# EAGLE design 3ch_LD_driver (EAGLE 9.7.0)
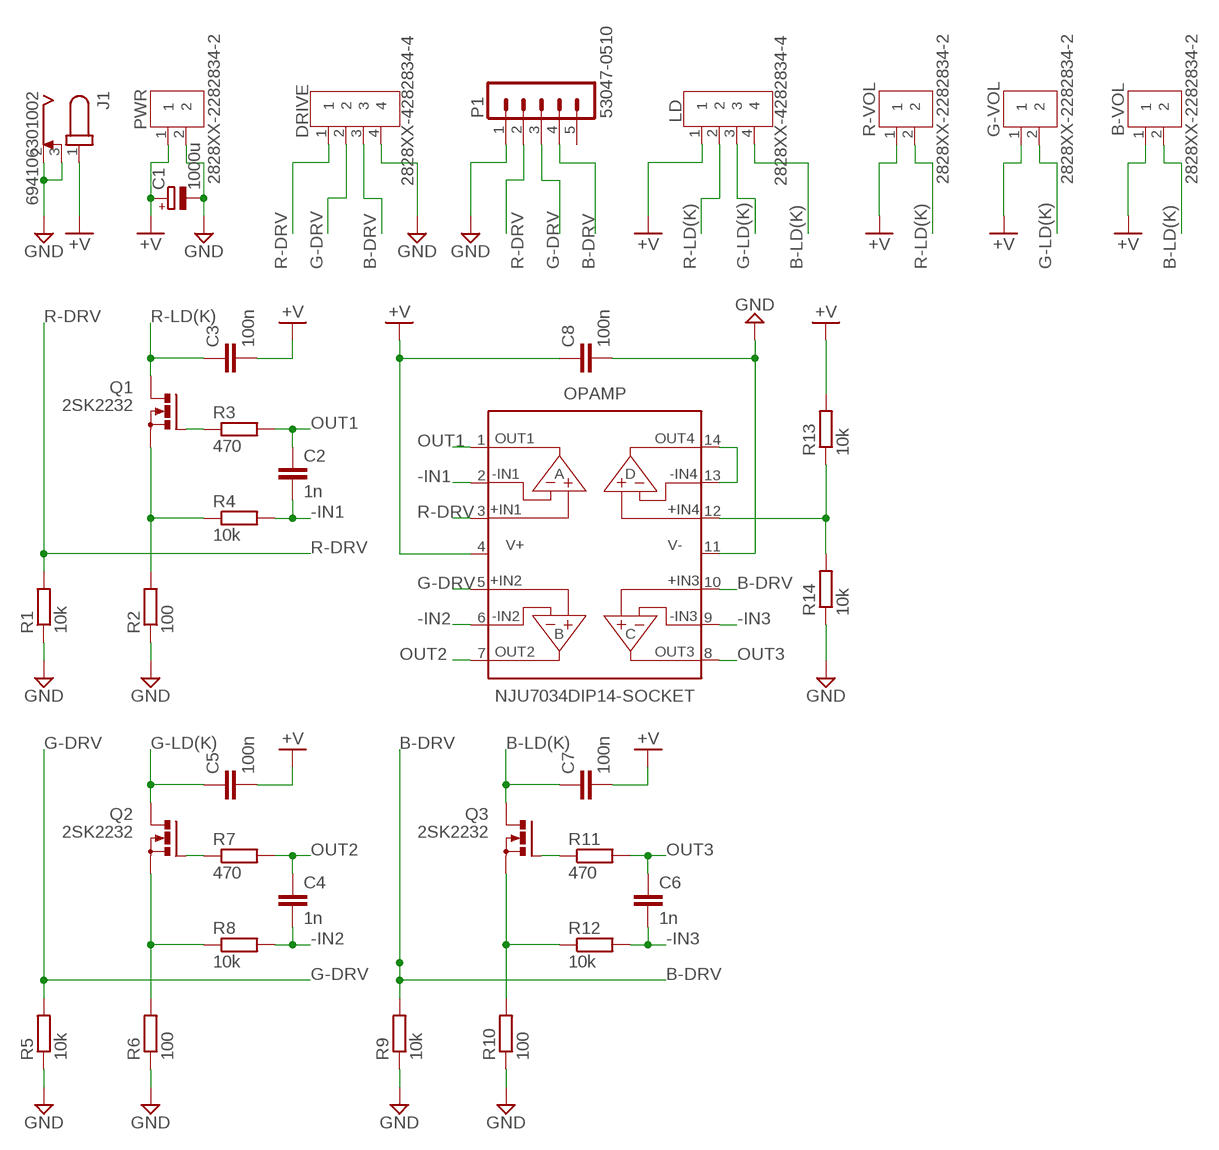
[diagram p0: schematic, sheet 1]

## Parts
B-VOL  2828XX-2282834-2  [TERMBLK_254-2N]
C1  1000u  CPOL-EUE5-10.5  [E5-10,5]
C2  1n  C-EU025-024X044  [C025-024X044]
C3  100n  C-EU025-024X044  [C025-024X044]
C4  1n  C-EU025-024X044  [C025-024X044]
C5  100n  C-EU025-024X044  [C025-024X044]
C6  1n  C-EU025-024X044  [C025-024X044]
C7  100n  C-EU025-024X044  [C025-024X044]
C8  100n  C-EU025-024X044  [C025-024X044]
DRIVE  2828XX-4282834-4  [TERMBLK_254-4N]
G-VOL  2828XX-2282834-2  [TERMBLK_254-2N]
J1  694106301002  [694106301002]
LD  2828XX-4282834-4  [TERMBLK_254-4N]
OPAMP  NJU7034DIP14-SOCKET  [DIP14-SOCKET]
P1  53047-0510  [53047-0510]
PWR  2828XX-2282834-2  [TERMBLK_254-2N]
Q1  2SK2232  PMOSFET_NTO220BV  [TO220BV]
Q2  2SK2232  PMOSFET_NTO220BV  [TO220BV]
Q3  2SK2232  PMOSFET_NTO220BV  [TO220BV]
R1  10k  R-EU_0207/10  [0207/10]
R2  100  R-EU_0207/10  [0207/10]
R3  470  R-EU_0207/10  [0207/10]
R4  10k  R-EU_0207/10  [0207/10]
R5  10k  R-EU_0207/10  [0207/10]
R6  100  R-EU_0207/10  [0207/10]
R7  470  R-EU_0207/10  [0207/10]
R8  10k  R-EU_0207/10  [0207/10]
R9  10k  R-EU_0207/10  [0207/10]
R10  100  R-EU_0207/10  [0207/10]
R11  470  R-EU_0207/10  [0207/10]
R12  10k  R-EU_0207/10  [0207/10]
R13  10k  R-EU_0207/10  [0207/10]
R14  10k  R-EU_0207/10  [0207/10]
R-VOL  2828XX-2282834-2  [TERMBLK_254-2N]

## Nets
+V: B-VOL.1 C1.+ C3.2 C5.2 C7.2 C8.1 G-VOL.1 J1.1 LD.1 OPAMP.4(V+) PWR.1 R13.2 R-VOL.1
-IN1: C2.2 OPAMP.2(-IN1) R4.2
-IN2: C4.2 OPAMP.6(-IN2) R8.2
-IN3: C6.2 OPAMP.9(-IN3) R12.2
B-DRV: DRIVE.3 OPAMP.10(+IN3) P1.4 R9.2
B-LD(K): B-VOL.2 C7.1 LD.4 Q3.D
G-DRV: DRIVE.2 OPAMP.5(+IN2) P1.3 R5.2
G-LD(K): C5.1 G-VOL.2 LD.3 Q2.D
GND: C1.- C8.2 DRIVE.4 J1.2 J1.3 OPAMP.11(V-) P1.1 PWR.2 R1.1 R2.1 R5.1 R6.1 R9.1 R10.1 R14.1
N$1: Q2.S R6.2 R8.1
N$2: Q1.G R3.1
N$3: Q1.S R2.2 R4.1
N$4: Q2.G R7.1
N$5: Q3.S R10.2 R12.1
N$6: Q3.G R11.1
N$7: OPAMP.13(-IN4) OPAMP.14(OUT4)
N$8: OPAMP.12(+IN4) R13.1 R14.2
OUT1: C2.1 OPAMP.1(OUT1) R3.2
OUT2: C4.1 OPAMP.7(OUT2) R7.2
OUT3: C6.1 OPAMP.8(OUT3) R11.2
R-DRV: DRIVE.1 OPAMP.3(+IN1) P1.2 R1.2
R-LD(K): C3.1 LD.2 Q1.D R-VOL.2
Unconnected: P1.5

## Library data of the parts
B-VOL G-VOL PWR R-VOL = Connector:2828XX-2: 2 Position Wire to Board Terminal Block Horizontal with Board Datasheet <https://www.te.com.cn/commerce/DocumentDelivery/DDEController?Action=showdoc&DocId=Catalog+Section%7F1308389_EUROSTYLE_TERMINAL_BLOCKS%7F0607%7Fpdf%7FEnglish%7FENG_CS_1308389_EUROSTYLE_TERMINAL_BLOCKS_0607.pdf%7F2-282837-5>
C1 = rcl:CPOL-EU: POLARIZED CAPACITOR, European symbol; SPICEPREFIX: C
C2-C8 = rcl:C-EU: CAPACITOR, European symbol; SPICEPREFIX: C
DRIVE LD = Connector:2828XX-4: 4 Position Wire to Board Terminal Block Horizontal with Board Datasheet <https://www.te.com.cn/commerce/DocumentDelivery/DDEController?Action=showdoc&DocId=Catalog+Section%7F1308389_EUROSTYLE_TERMINAL_BLOCKS%7F0607%7Fpdf%7FEnglish%7FENG_CS_1308389_EUROSTYLE_TERMINAL_BLOCKS_0607.pdf%7F2-282837-5>; CATEGORY: Connector; DESCRIPTION: TERM BLK 4P SIDE ENT 2.54mm PCB; MANUFACTURER: TE Connectivity; MPN: 282834-4; OPERATING_TEMPERATURE: 40°C to +105°C; PART_STATUS: Active; ROHS_COMPLIANCE: RoHS Compliant; SERIES: 282834; SUBCATEGORY: Terminal Block; TYPE: Side Wire Entry
J1 = DC Power Jacks:694106301002: CONN PWR JACK 2.1X5.5MM SOLDER Manufacturer's datasheet <https://katalog.we-online.de/em/datasheet/6941xx301002.pdf>; CREATED_BY: PCBLayout.com; DIGIKEY_PART_NUMBER: 732-5930-ND; MANUFACTURER: Wurth Electronics Inc.; MPN: 694106301002
OPAMP = 秋月電子通商:NJU7034
P1 = molex:53047-0510: HEADER Check availability <https://pricing.snapeda.com/parts/53047-0510/Molex/view-part?ref=eda>; AVAILABILITY: In Stock; DESCRIPTION: Connector Header Through Hole 5 position 0.049 (1.25mm); MF: Molex; MP: 53047-0510; PACKAGE: None; PRICE: None; PURCHASE-URL: https://pricing.snapeda.com/search/part/53047-0510/?ref=eda
Q1-Q3 = transistor-power:PMOSFET_N: Power MOSFET N-Channel
R1-R14 = rcl:R-EU_: RESISTOR, European symbol; SPICEPREFIX: R

## Net classes
0 default: width 0.61 mm, clearance 0.508 mm

## Board
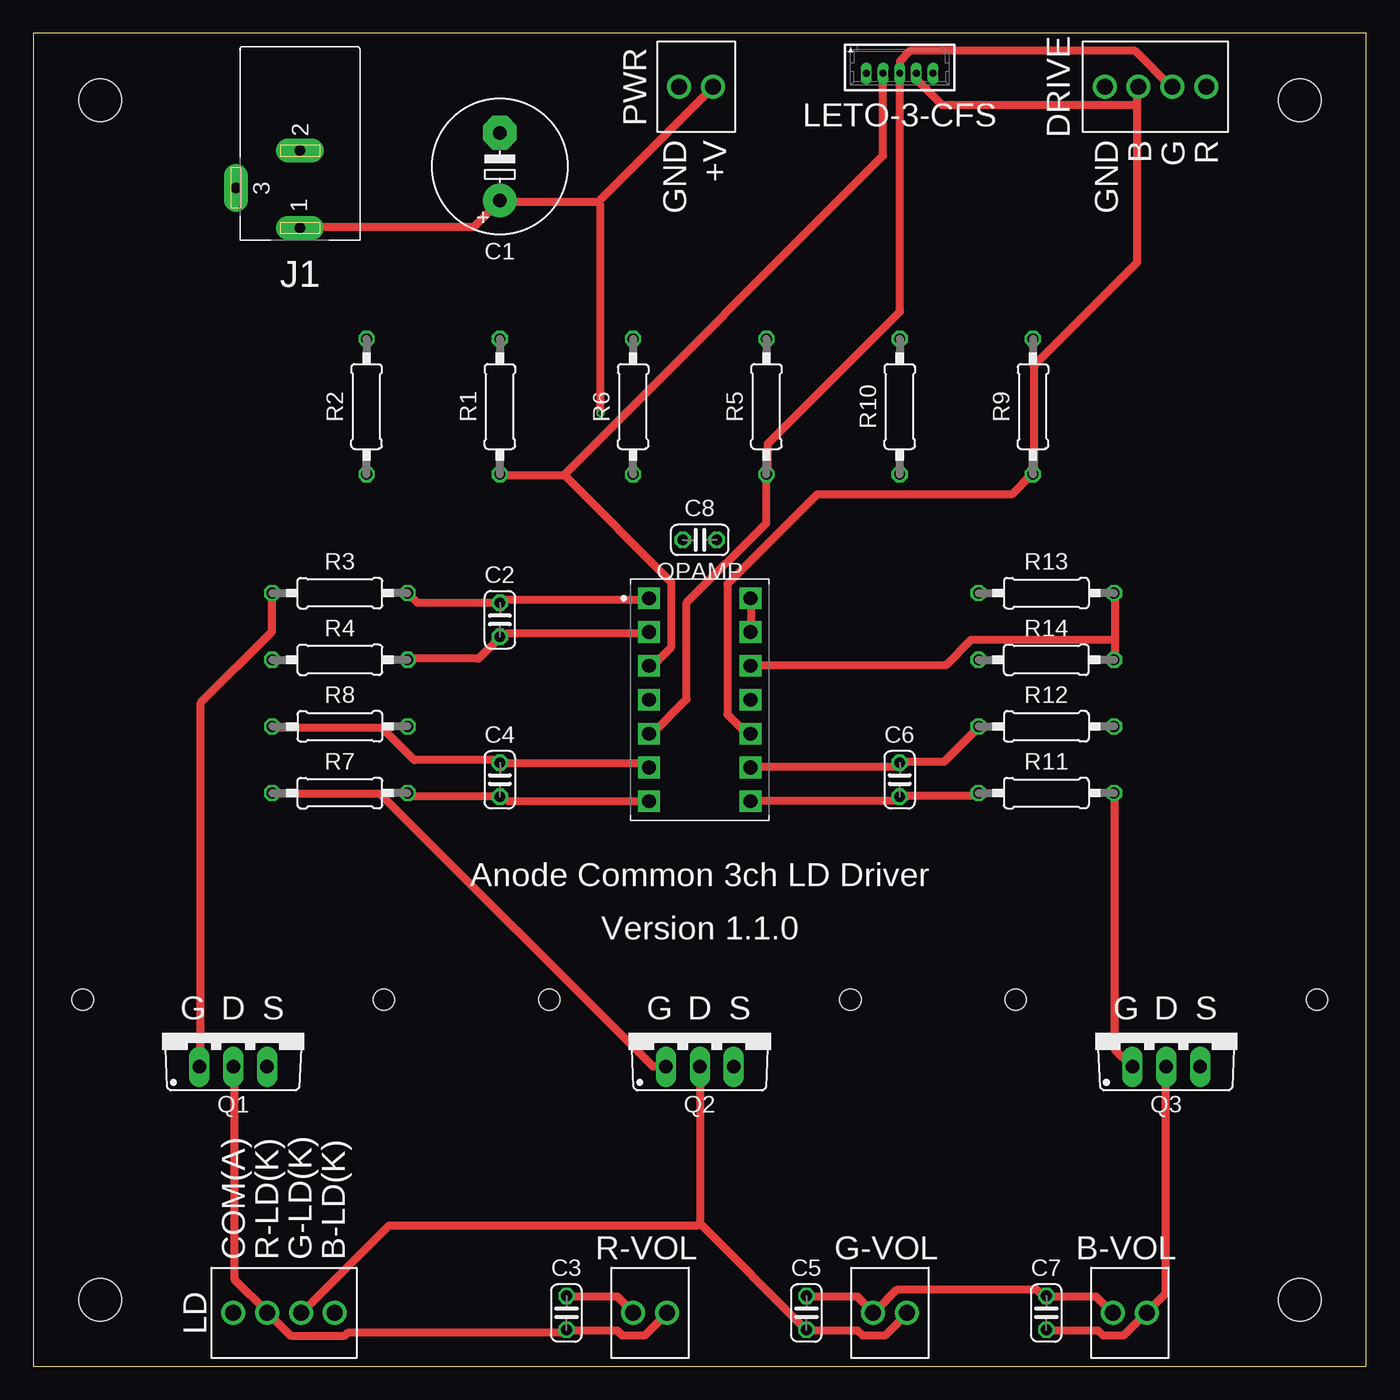
[diagram p1: board, top side]
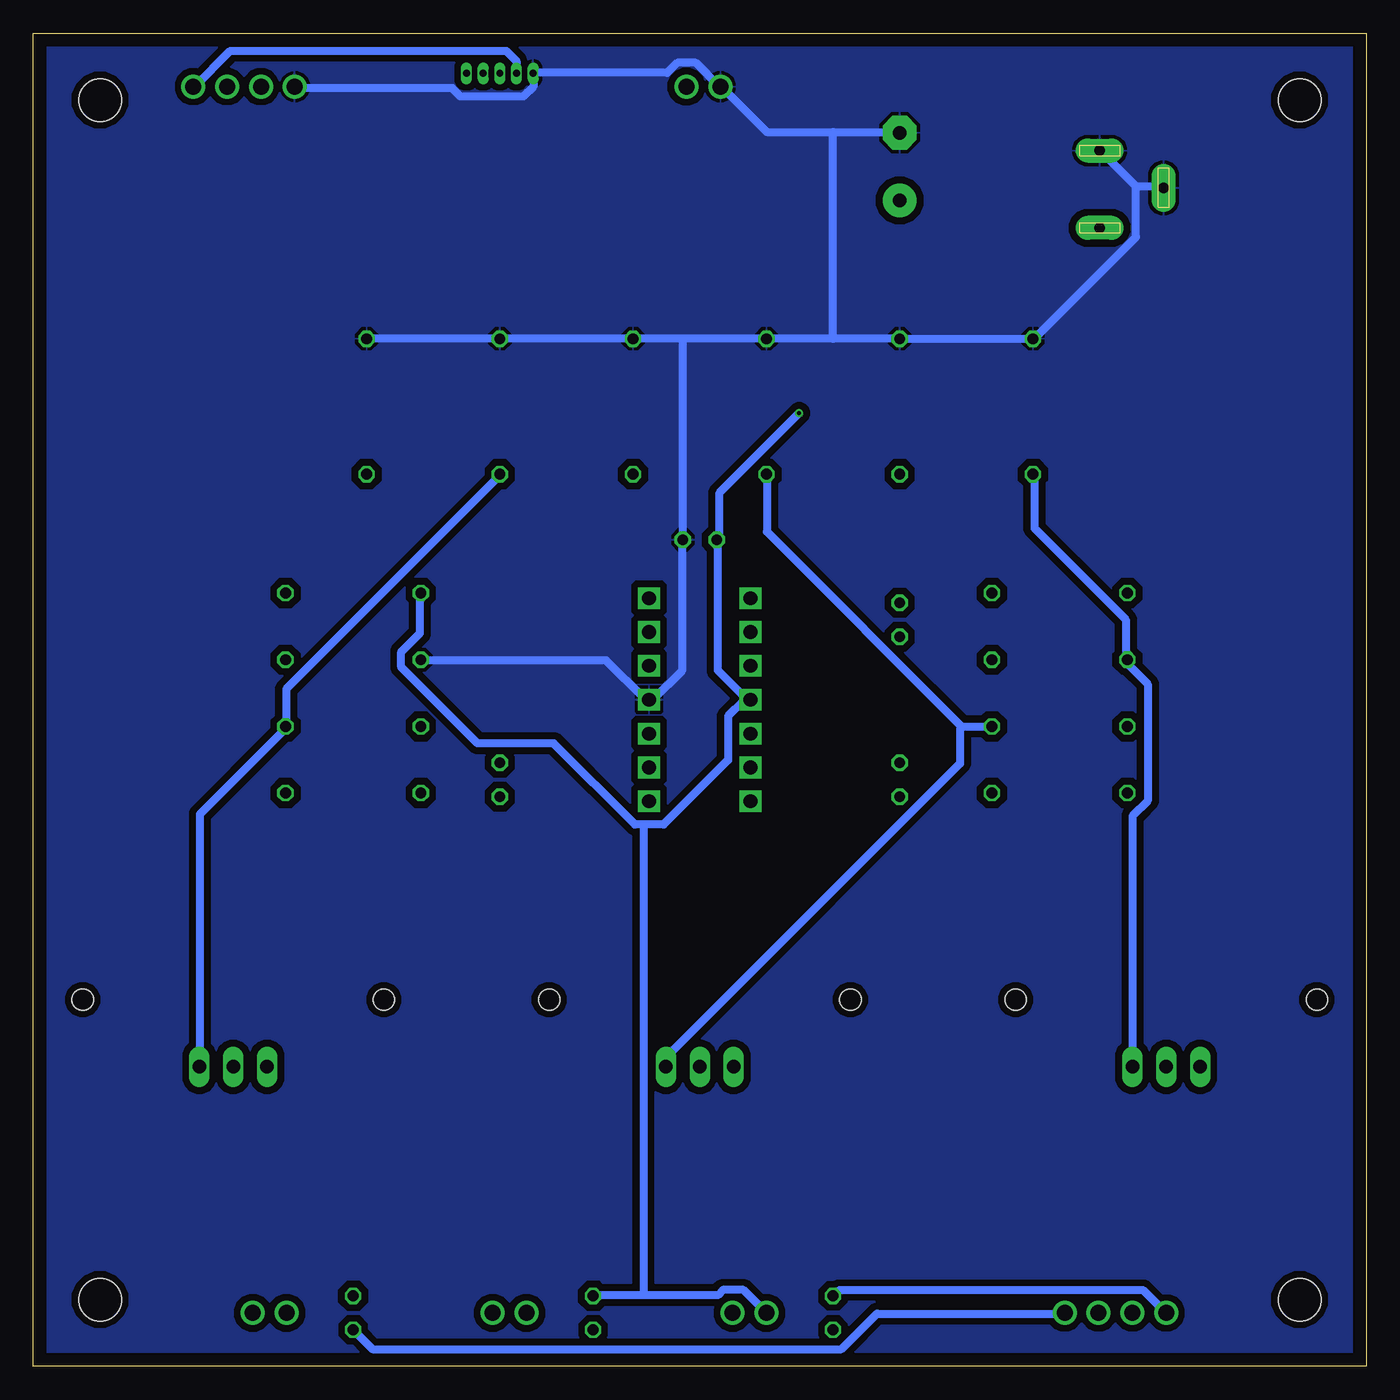
[diagram p2: board, bottom side, seen from below]

Size 100 x 100 mm. Coordinates in mm from the lower left corner, seen from the top.
Outline: 0,0 100,0 100,100 0,100 0,0
Copper layers (1*16): Top / Bottom
Stack-up Default Layer Stack: Top User Defined 0.035mm / Dielectric-1 User Defined 1.6mm / Bottom User Defined 0.035mm
Design rules "Elecrow_2-layer_PCB_eagle_rule": minimum track width 6mil, minimum drill 12mil, track to track 6mil, track to pad 6mil, pad to pad 6mil, via to via 8mil, smd to smd 0mil, copper to edge 20mil, drill to drill 10mil, minimum pad ring 6mil, minimum via ring 6mil, stop-mask expansion 0mil, vias tented up to drill 100mil, thermal gap 10mil
Holes 3.2 mm at 5,95 5,5 95,5 95,95
Holes 1.6 mm at 26.3,27.5 3.7,27.5 38.7,27.5 61.3,27.5 73.7,27.5 96.3,27.5

### Footprints (pad centres in the part's own frame; a part is rotated, then mirrored left to right if it is on the bottom)
TERMBLK_254-2N = drill 1.2: 1 0,0; 2 2.54,0
E5-10,5 = drill 1.016 pad 2.54: + -2.54,0 | drill 1.016 pad 2.54 octagon: - 2.54,0
C025-024X044 = drill 0.813 octagon: 1 -1.27,0; 2 1.27,0
TERMBLK_254-4N = drill 1.2: 1 0,0; 2 2.54,0; 3 5.08,0; 4 7.62,0
694106301002 = drill 0.8 pad 1.8 long: 1 13.6,0; 2 7.8,0; 3 10.6,-4.8
DIP14-SOCKET = drill 1.02 pad 1.62 square: 1 -3.81,7.62; 2 -3.81,5.08; 3 -3.81,2.54; 4 -3.81,0; 5 -3.81,-2.54; 6 -3.81,-5.08; 7 -3.81,-7.62; 8 3.81,-7.62; 9 3.81,-5.08; 10 3.81,-2.54; 11 3.81,0; 12 3.81,2.54; 13 3.81,5.08; 14 3.81,7.62
53047-0510 = drill 0.508 long: 1 2.5,0; 2 1.25,0; 3 0,0; 4 -1.25,0; 5 -2.5,0
TO220BV = drill 1.016 long: D 0,-2.54; G -2.54,-2.54; S 2.54,-2.54
0207/10 = drill 0.813 octagon: 1 -5.08,0; 2 5.08,0

### Placement (x,y rotation side)
B-VOL  81,4 0 top
C1  35,90 90 top
C2  35,56 270 top
C3  40,4 90 top
C4  35,44 90 top
C5  58,4 90 top
C6  65,44 90 top
C7  76,4 90 top
C8  50,62 0 top
DRIVE  88,96 180 top
G-VOL  63,4 0 top
J1  20,99 270 top
LD  15,4 0 top
OPAMP  50,50 0 top
P1  65,97 180 top
PWR  51,96 180 top
Q1  15,25 0 top
Q2  50,25 0 top
Q3  85,25 0 top
R1  35,72 270 top
R2  25,72 270 top
R3  23,58 0 top
R4  23,53 0 top
R5  55,72 270 top
R6  45,72 270 top
R7  23,43 0 top
R8  23,48 180 top
R9  75,72 270 top
R10  65,72 270 top
R11  76,43 180 top
R12  76,48 180 top
R13  76,58 180 top
R14  76,53 0 top
R-VOL  45,4 0 top

### Tracks (layer width: path | path; a pad name or v marks a point on that pad's centre or on a via)
+V  (via drill 0.3)
  Top 0.61: C5.2 58.04,5.21 61.85,5.21 62.99,4.06 G-VOL.1 63.25,4.19 64.77,5.71 75.31,5.71 75.69,5.33 C7.2 76.07,5.21 79.76,5.21 80.9,4.06 B-VOL.1 | C3.2 40.01,5.21 43.81,5.21 44.96,4.06 R-VOL.1 | J1.1 20.07,85.47 33.02,85.47 34.92,87.38 C1.+ 35.31,87.38 42.42,87.38 | 42.42,87.38 50.93,95.89 PWR.1 | v42.55,71.5 42.55,87.12 42.42,87.38
  Bottom 0.61: LD.1 15.11,4.06 16.76,5.71 39.5,5.71 39.88,5.33 C3.2 | 54.23,5.33 48.64,5.33 48.26,5.71 46.74,5.71 45.09,4.06 R-VOL.1 | 54.23,5.33 57.91,5.33 C5.2 | 54.23,40.64 52.7,40.64 47.88,45.47 47.88,48.77 46.74,49.91 OPAMP.4 46.23,50.04 46.48,50.04 48.64,52.2 48.64,61.98 C8.1 48.51,62.23 48.51,65.53 v42.55,71.5 | 54.23,40.64 54.86,40.64 60.96,46.74 66.67,46.74 72.39,52.45 72.39,53.59 70.99,54.99 70.99,57.91 R13.2 | 54.23,40.64 54.23,5.33
-IN1
  Top 0.61: R4.2 28.19,53.09 33.4,53.09 34.92,54.61 C2.2 35.31,54.74 35.56,54.99 46.1,54.99 OPAMP.2
-IN2
  Top 0.61: OPAMP.6 46.1,44.96 45.85,45.21 35.05,45.21 C4.2 34.8,45.47 28.57,45.47 26.16,47.88 18.03,47.88 R8.2
-IN3
  Top 0.61: R12.2 70.87,47.88 68.33,45.34 65.02,45.34 C6.2 64.77,45.09 64.64,44.96 53.85,44.96 OPAMP.9
B-DRV
  Top 0.61: 82.8,94.61 82.8,95.89 DRIVE.3 | 82.8,94.61 82.8,82.8 75.06,75.06 75.06,66.93 R9.2 74.8,66.8 73.41,65.41 58.8,65.41 52.07,58.67 52.07,48.9 53.47,47.5 53.72,47.5 OPAMP.10 | 82.8,94.61 68.2,94.61 66.29,96.52 66.29,96.9 P1.4
B-LD(K)
  Top 0.61: C7.1 76.07,2.67 79.88,2.67 80.26,2.29 81.79,2.29 83.44,3.94 B-VOL.2 83.69,4.19 84.96,5.46 84.96,22.35 Q3.D
  Bottom 0.61: LD.4 22.73,3.94 36.7,3.94 39.37,1.27 74.55,1.27 75.95,2.67 C7.1
G-DRV
  Top 0.61: DRIVE.2 85.34,96.01 82.68,98.68 65.79,98.68 65.02,97.92 65.02,97.03 P1.3 65.02,96.77 65.02,79.12 55.12,69.22 55.12,67.18 R5.2 54.99,66.8 54.99,63.25 49.02,57.28 49.02,50.04 46.48,47.5 46.23,47.5 OPAMP.5
G-LD(K)
  Top 0.61: G-VOL.2 65.53,3.94 63.88,2.29 62.23,2.29 61.85,2.67 58.04,2.67 C5.1 57.78,2.92 50.04,10.67 | 50.04,10.67 50.04,22.35 Q2.D | LD.3 20.19,4.06 26.67,10.54 49.78,10.54 50.04,10.67
GND
  Bottom 0.61: DRIVE.4 80.26,95.89 68.58,95.89 67.94,95.25 63.25,95.25 62.48,96.01 62.48,96.77 P1.1 62.48,97.03 52.45,97.03 51.69,97.79 50.29,97.79 48.51,96.01 PWR.2 48.26,95.89 44.96,92.58 40.01,92.58 | 40.01,92.58 35.05,92.58 C1.- | R14.1 70.87,52.96 57.02,52.96 54.1,50.04 OPAMP.11 53.72,50.04 53.47,50.04 51.31,52.2 51.31,61.98 C8.2 51.31,62.23 51.31,77.09 | 17.27,88.52 15.24,88.52 J1.3 | 17.27,88.52 19.94,91.19 J1.2 | 40.01,77.09 35.31,77.09 R1.1 34.92,77.09 25.02,77.09 R2.1 24.77,77.22 17.27,84.71 17.27,88.52 | 40.01,77.09 44.96,77.09 R6.1 45.21,77.09 51.31,77.09 | 51.31,77.09 R5.1 55.24,77.09 64.9,77.09 R10.1 65.28,77.09 74.93,77.09 R9.1 | 40.01,77.09 40.01,92.58
  pour Bottom: 1,99 1,1 99,1 99,99
N$1
  Bottom 0.61: 30.35,48.01 28.19,48.01 R8.1 | 30.35,48.01 44.96,62.61 44.96,66.8 R6.2 | Q2.S 52.45,22.48 52.45,23.24 30.48,45.21 30.48,47.75 30.35,48.01
N$2
  Top 0.61: R3.1 17.91,57.91 17.91,55.12 12.57,49.78 12.57,22.48 Q1.G
N$3
  Bottom 0.61: R2.2 24.89,66.8 24.89,62.87 18.03,56.01 18.03,53.09 R4.1 17.91,52.7 16.38,51.18 16.38,42.42 17.53,41.27 17.53,22.48 Q1.S
N$4
  Top 0.61: R7.1 18.03,42.93 26.04,42.93 46.48,22.48 47.37,22.48 Q2.G
N$5
  Bottom 0.61: R10.2 65.02,66.8 81.03,50.8 81.03,48.01 R12.1 81.15,47.75 87.5,41.4 87.5,22.48 Q3.S
N$6
  Top 0.61: R11.1 81.15,42.93 81.15,23.75 82.42,22.48 Q3.G
N$7
  Top 0.61: OPAMP.13 53.85,55.12 53.85,57.53 OPAMP.14
N$8
  Top 0.61: 81.15,54.48 81.15,57.91 R13.1 | 81.15,54.48 81.15,53.09 R14.2 | 81.15,54.48 70.36,54.48 68.45,52.58 53.85,52.58 OPAMP.12
OUT1
  Top 0.61: R3.2 28.19,57.91 28.83,57.28 34.92,57.28 C2.1 35.18,57.53 46.1,57.53 OPAMP.1
OUT2
  Top 0.61: R7.2 28.19,42.93 28.32,42.8 34.92,42.8 C4.1 35.31,42.67 35.56,42.42 46.1,42.42 OPAMP.7
OUT3
  Top 0.61: R11.2 70.87,42.93 70.74,42.8 65.02,42.8 C6.1 64.77,42.55 64.64,42.42 53.85,42.42 OPAMP.8
R-DRV
  Top 0.61: 39.88,66.8 35.05,66.8 R1.2 | 39.88,66.8 47.88,58.8 47.88,53.98 46.48,52.58 46.23,52.58 OPAMP.3 | P1.2 63.75,96.9 63.75,90.81 40.01,67.06 39.88,66.8
  Bottom 0.61: P1.2 63.75,97.03 63.75,97.92 64.52,98.68 85.22,98.68 87.88,96.01 DRIVE.1
R-LD(K)
  Top 0.61: R-VOL.2 47.5,3.94 45.85,2.29 44.2,2.29 43.81,2.67 40.01,2.67 C3.1 39.75,2.54 23.62,2.54 23.37,2.29 19.3,2.29 17.78,3.81 LD.2 17.53,4.06 15.11,6.48 15.11,22.35 Q1.D

### Text on the board
tNames: LETO-3-CFS | GND | +V | GND | B | G | R | Anode Common 3ch LD Driver | Version 1.1.0 | G | D | S | G | D | S | G | D | S | COM(A) | R-LD(K) | G-LD(K) | B-LD(K)